# Altium schematic sheet LDO_3v3_LM2937.SchDoc
size A; SheetNumber: 2; SheetTotal: 6
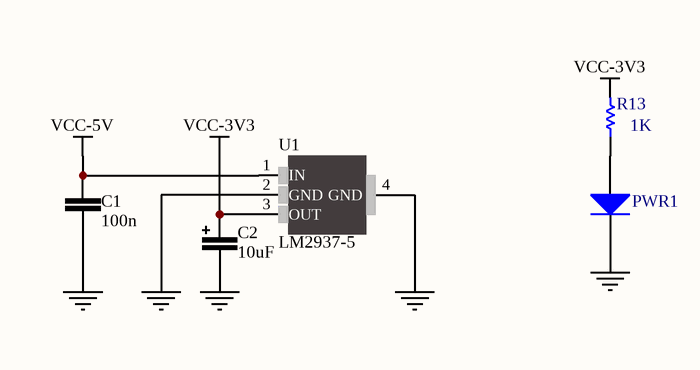
[diagram p0: LDO_3v3_LM2937.SchDoc]

## Parts
C1  100n  [CER_0603]
C2  10uF  [TANT_1210]
PWR1  (no value)  [SMC]
R13  value 1K  [AXIAL-0.3]
U1  LM2937-5  [SOT223]

## Nets
GND: C1.1 C2.2 PWR1.2(K) U1.2(GND) U1.4(GND)
VCC-3V3: C2.1 U1.3(OUT)
VCC-5V: C1.2 U1.1(IN)
NetPWR1_1: PWR1.1(A) R13.1

Not connected (* = marked no-connect by the designer): R13 2

## Notes on the sheet
- Labels drawn without touching a wire or pin: VCC-3V3

## Library data of the parts
C1 = 06032105: CAP CER 100n 10V X5R 10% 0603; Capacitance: 100n
C2 = 00001106: CAP TANT 10u; Value: 10uF
PWR1 = Diode: Default Diode; Published: 8-Jun-2000; LatestRevisionDate: 17-Jul-2002; LatestRevisionNote: Re-released for DXP Platform.; PackageVersion: Sep-1996; PackageReference: SMC; Publisher: Altium Limited; PackageDescription: DO-214-AB/SMC; 2 C-Bend Leads; Body 7.9 x 5.9 mm, inc. leads (LxW); Code_JEDEC: DO-214-AB
R13 = Res1: Resistor; Published: 8-Jun-2000; LatestRevisionDate: 17-Jul-2002; LatestRevisionNote: Re-released for DXP Platform.; PackageReference: AXIAL-0.3; Publisher: Altium Limited; PackageDescription: Axial Device, Thru-Hole; 2 Leads; 0.3 in Pin Spacing
U1 = 00000007: IC REG LINEAR 5V 400MA SOT223-4; Manufacturer Part Number: LM2937-5; Datasheet Link: http://www.ti.com/lit/ds/symlink/lm2937.pdf